# Altium schematic sheet USB_OTG.SchDoc: USB_OTG_HS
size A4; DocumentNumber: MB1246; Revision: B.2; SheetNumber: 8; SheetTotal: 17; Project: STM32H7x3I-EVAL
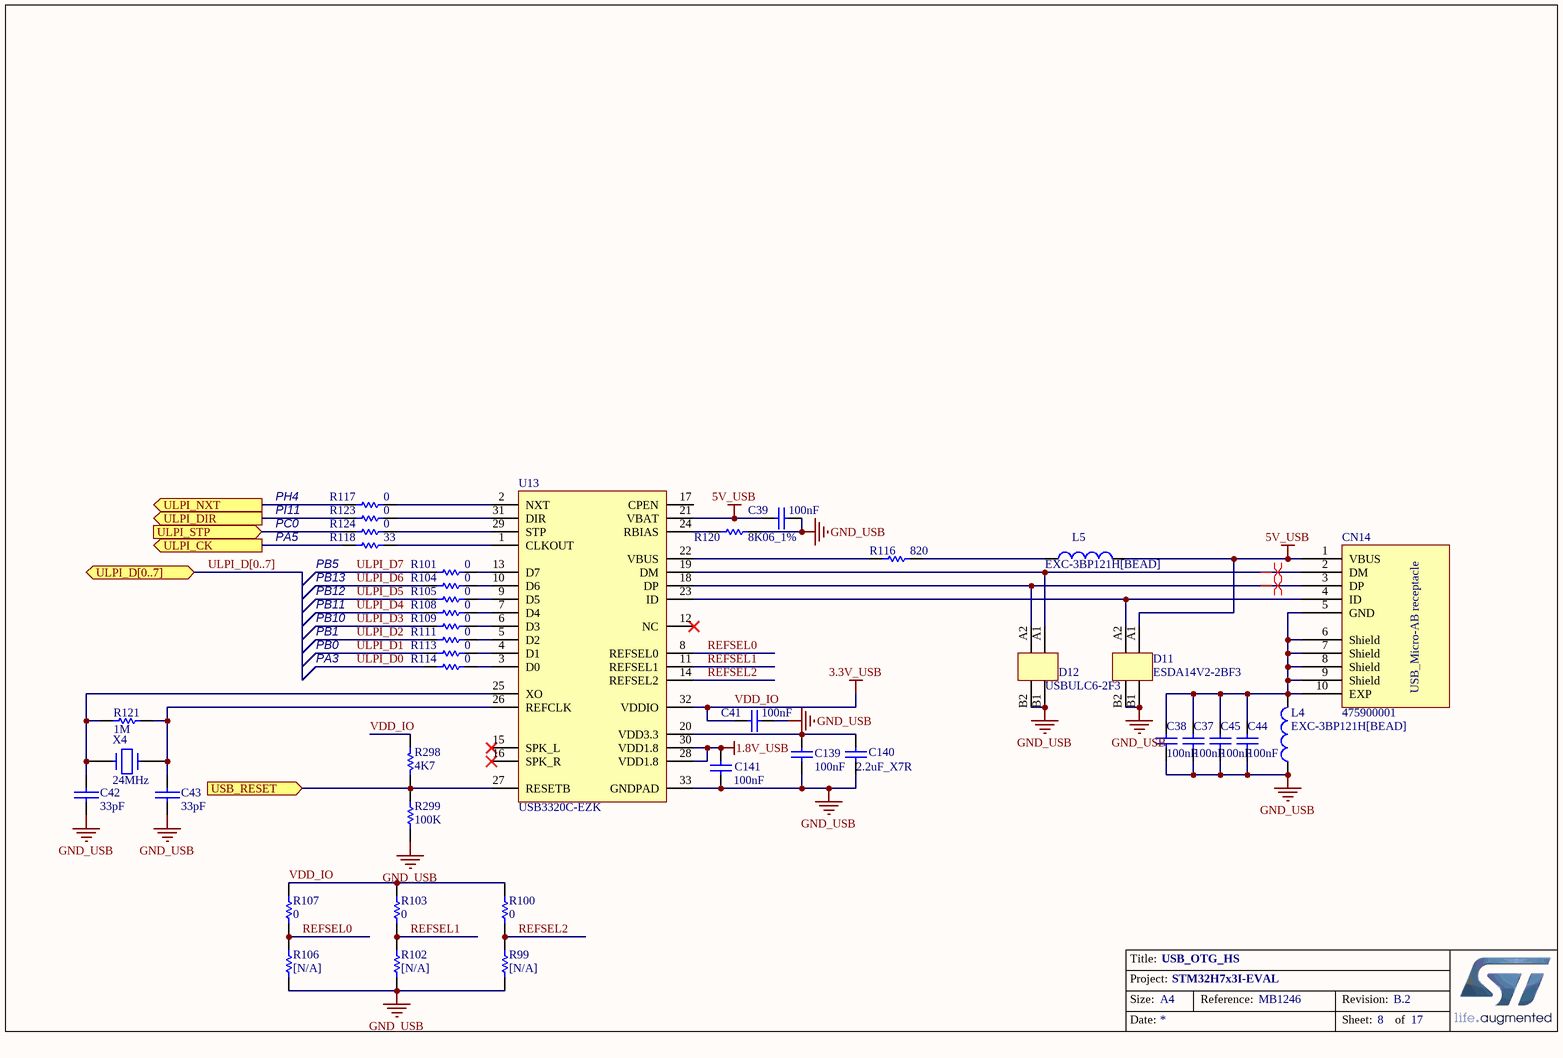
[diagram p0: USB_OTG.SchDoc]

## Parts
C37  100nF  [0603C]
C38  100nF  [0603C]
C39  100nF  [0603C]
C41  100nF  [0603C]
C42  33pF  [0603C]
C43  33pF  [0603C]
C44  100nF  [0603C]
C45  100nF  [0603C]
C139  100nF  [0603C]
C140  2.2uF_X7R  [0603C]
C141  100nF  [0603C]
CN14  475900001  [MOLEX_47590001]
D11  ESDA14V2-2BF3  [BGA4_0R4_0R8X0R8]
D12  USBULC6-2F3  [BGA4_0R4_1X1]
L4  EXC-3BP121H[BEAD]  [0603L]
L5  EXC-3BP121H[BEAD]  [0603L]
R99  [N/A]  [0603R]
R100  0  [0603R]
R101  0  [0603R]
R102  [N/A]  [0603R]
R103  0  [0603R]
R104  0  [0603R]
R105  0  [0603R]
R106  [N/A]  [0603R]
R107  0  [0603R]
R108  0  [0603R]
R109  0  [0603R]
R111  0  [0603R]
R113  0  [0603R]
R114  0  [0603R]
R116  820  [0603R]
R117  0  [0603R]
R118  33  [0603R]
R120  8K06_1%  [0603R]
R121  1M  [0603R]
R123  0  [0603R]
R124  0  [0603R]
R298  4K7  [0603R]
R299  100K  [0603R]
U13  USB3320C-EZK  [QFN32_0R5_5X5]
X4  24MHz  [XTAL1]

## Ports
ULPI_CK (out), ULPI_D[0..7] (bidir), ULPI_DIR (out), ULPI_NXT (out), ULPI_STP (in), USB_RESET (in)

## Nets
1.8V_USB: C141.1 U13.28(VDD1.8) U13.30(VDD1.8)
5V_USB: C39.1 CN14.1(VBUS) D11.A1 L5.2 U13.21(VBAT)
GND_USB: C37.2 C38.2 C39.2 C41.2 C42.2 C43.2 C44.2 C45.2 C139.2 C140.1 C141.2 D11.B1 D11.B2 D12.B1 D12.B2 L4.1 R99.1 R102.1 R106.1 R120.2 R299.1 U13.33(GNDPAD)
VDD_IO: C41.1 R100.2 R103.2 R107.2 R298.2 U13.32(VDDIO)  [also labelled 3.3V_USB]
REFSEL0: R106.2 R107.1 U13.8(REFSEL0)
REFSEL1: R102.2 R103.1 U13.11(REFSEL1)
REFSEL2: R99.2 R100.1 U13.14(REFSEL2)
ULPI_CK: R118.2 ; port ULPI_CK
ULPI_D0: R114.2
ULPI_D1: R113.2
ULPI_D2: R111.2
ULPI_D3: R109.2
ULPI_D4: R108.2
ULPI_D5: R105.2
ULPI_D6: R104.2
ULPI_D7: R101.2
ULPI_DIR: R123.2 ; port ULPI_DIR
ULPI_NXT: R117.2 ; port ULPI_NXT
ULPI_STP: R124.2 ; port ULPI_STP
USB_RESET: R298.1 R299.2 U13.27(RESETB) ; port USB_RESET
NetC37_1: C37.1 C38.1 C44.1 C45.1 CN14.5(GND) CN14.6(Shield) CN14.7(Shield) CN14.8(Shield) CN14.9(Shield) CN14.10(EXP) L4.2
NetC42_1: C42.1 R121.1 U13.25(XO) X4.2
NetC43_1: C43.1 R121.2 U13.26(REFCLK) X4.1
NetC139_1: C139.1 C140.2 U13.20(VDD3.3)
NetCN14_2: CN14.2(DM) D12.A1 U13.19(DM)
NetCN14_3: CN14.3(DP) D12.A2 U13.18(DP)
NetCN14_4: CN14.4(ID) D11.A2 U13.23(ID)
NetL5_1: L5.1 R116.2
NetR101_1: R101.1 U13.13(D7)
NetR104_1: R104.1 U13.10(D6)
NetR105_1: R105.1 U13.9(D5)
NetR108_1: R108.1 U13.7(D4)
NetR109_1: R109.1 U13.6(D3)
NetR111_1: R111.1 U13.5(D2)
NetR113_1: R113.1 U13.4(D1)
NetR114_1: R114.1 U13.3(D0)
NetR116_1: R116.1 U13.22(VBUS)
NetR117_1: R117.1 U13.2(NXT)
NetR118_1: R118.1 U13.1(CLKOUT)
NetR120_1: R120.1 U13.24(RBIAS)
NetR123_1: R123.1 U13.31(DIR)
NetR124_1: R124.1 U13.29(STP)

Not connected (* = marked no-connect by the designer): U13 12(NC)* 15(SPK_L)* 16(SPK_R)* 17(CPEN)

## Buses and harness runs
bus ULPI_D[0..7] = port ULPI_D[0..7]

## Layout directives
differential pair: NetCN14_2, NetCN14_3

## Notes on the sheet
- PH4
- PI11
- PC0
- PA5
- PB13
- PB5
- PB0
- PB1
- PB10
- PB11
- PB12
- PA3
- Title:
- Project:
- Size:
- Date:
- A4
- Reference:
- Sheet:
- Revision:
- of
- (in symbol 475900001) USB_Micro-AB receptacle

## Library data of the parts
C37-C39 C41 C44 C45 C139-C141 = Cap: Capacitor; Value: 10nF; Published: 8-Jun-2000; Revision: July-2002: Re-released for DXP Platform.; Publisher: Altium Limited
C42 C43 = CAP: Capacitor
L4 L5 = Inductor: Value: 100uH; Published: 8-Jun-2000; Revision: July-2002: Re-released for DXP Platform.; Publisher: Altium Limited
R99-R109 R111 R113 R114 R117 R118 R121 R123 R124 R298 = Res1: Resistor; Value: 1K; Published: 8-Jun-2000; Revision: July-2002: Re-released for DXP Platform.; Publisher: Altium Limited
R116 = res1: Resistor; Value: 1K; Published: 8-Jun-2000; Revision: July-2002: Re-released for DXP Platform.; Publisher: Altium Limited
R120 = Res_8K06_1%_0402: Resistor,8K06,0402,1%,YAGEO; Manuf_Part_1: RC0402FR-078K06L; Value: 8K06; Manuf_1: YAGEO; Order: RC0402FR-078K06L; ECCN_US/EU: n/a; Distrib: DIGIKEY
R299 = Resistor_ST: Resistor 0402 / 0603 / 0805; Value: 10K
U13 = USB3320C-EZK: USB3320C,  Hi-Speed USB Host, Device or OTG PHY with ULPI Low Pin Interface; Manuf_1: MICROCHIP; Manuf_Part_1: USB3320C-EZK-TR; Distrib: MICROCHIP; Order: USB3320C-EZK-TR; ECCN_US/EU: *
X4 = CRYSTAL